# EAGLE design pcb_schematic (EAGLE 6.5.0)
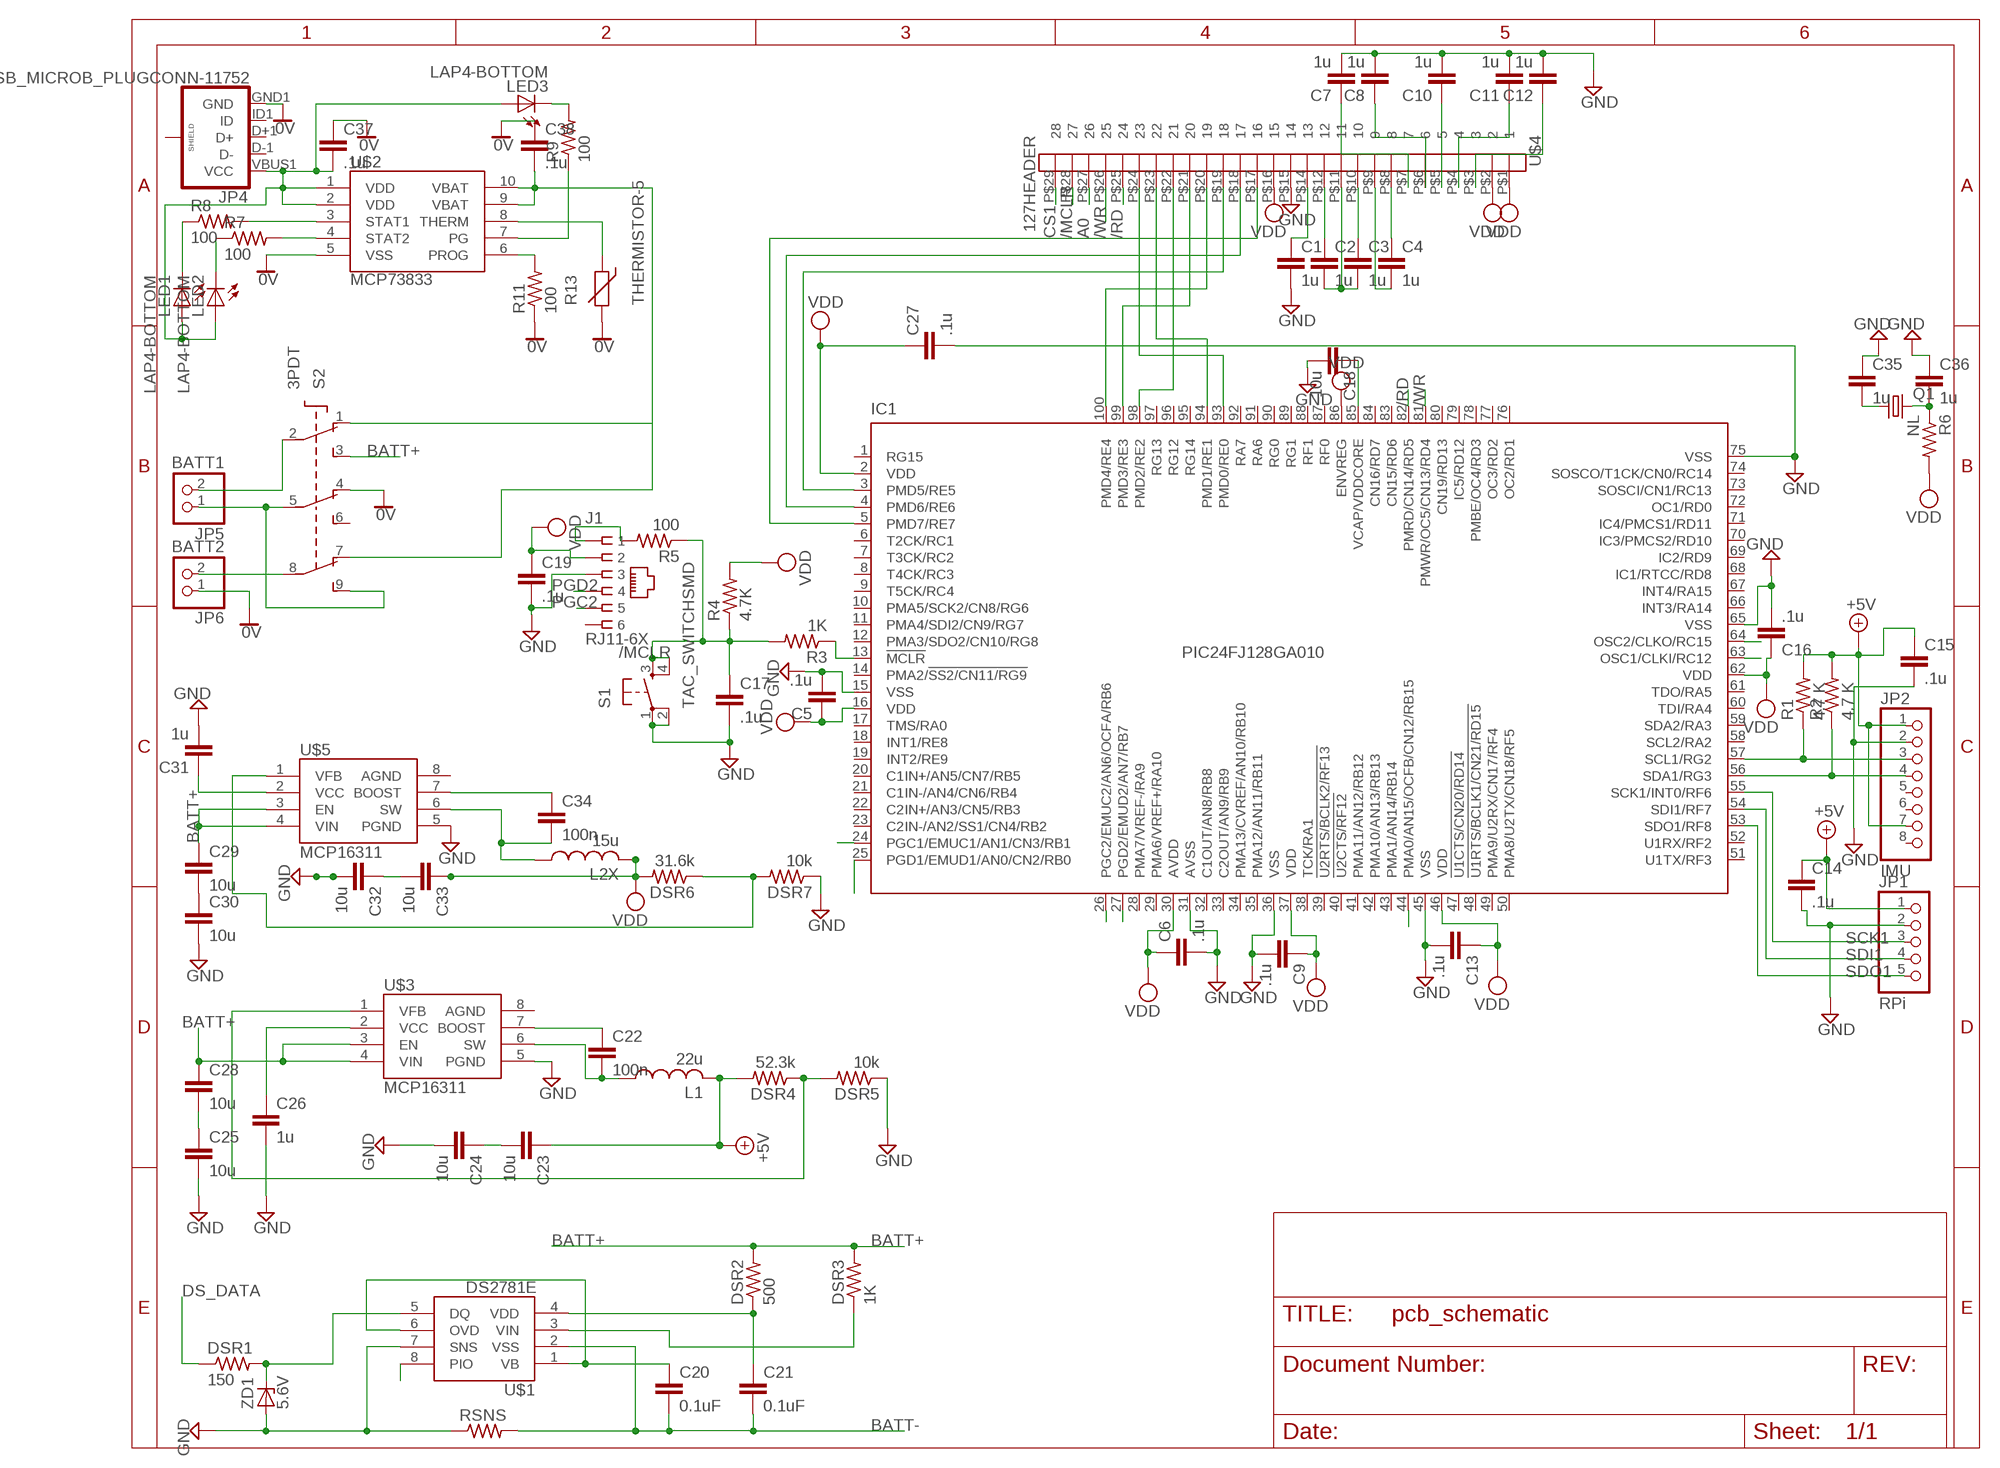
[diagram p0: schematic, sheet 1]

## Parts
C1  1u  C-EUC1206  [C1206]
C2  1u  C-EUC1206  [C1206]
C3  1u  C-EUC1206  [C1206]
C4  1u  C-EUC1206  [C1206]
C5  .1u  C-EUC1206  [C1206]
C6  .1u  C-EUC1206  [C1206]
C7  1u  C-EUC1206  [C1206]
C8  1u  C-EUC1206  [C1206]
C9  .1u  C-EUC1206  [C1206]
C10  1u  C-EUC1206  [C1206]
C11  1u  C-EUC1206  [C1206]
C12  1u  C-EUC1206  [C1206]
C13  .1u  C-EUC1206  [C1206]
C14  .1u  C-EUC1206  [C1206]
C15  .1u  C-EUC1206  [C1206]
C16  .1u  C-EUC1206  [C1206]
C17  .1u  C-EUC1206  [C1206]
C18  10u  C-EUC1206  [C1206]
C19  .1u  C-EUC1206  [C1206]
C20  0.1uF  C-EUC1206  [C1206]
C21  0.1uF  C-EUC1206  [C1206]
C22  100n  C-EUC1206  [C1206]
C23  10u  C-EUC1206  [C1206]
C24  10u  C-EUC1206  [C1206]
C25  10u  C-EUC1206  [C1206]
C26  1u  C-EUC1206  [C1206]
C27  .1u  C-EUC1206  [C1206]
C28  10u  C-EUC1206  [C1206]
C29  10u  C-EUC1206  [C1206]
C30  10u  C-EUC1206  [C1206]
C31  1u  C-EUC1206  [C1206]
C32  10u  C-EUC1206  [C1206]
C33  10u  C-EUC1206  [C1206]
C34  100n  C-EUC1206  [C1206]
C35  1u  C-EUC1206  [C1206]
C36  1u  C-EUC1206  [C1206]
C37  .1u  C-EUC1206  [C1206]
C38  .1u  C-EUC1206  [C1206]
DSR1  150  R-US_M2012  [M2012]
DSR2  500  R-US_M2012  [M2012]
DSR3  1K  R-US_M2012  [M2012]
DSR4  52.3k  R-US_M2012  [M2012]
DSR5  10k  R-US_M2012  [M2012]
DSR6  31.6k  R-US_M2012  [M2012]
DSR7  10k  R-US_M2012  [M2012]
IC1  PIC24FJ128GA010  [TQFP100-14X14]
J1  RJ11-6X  [RJ11-NO_SHIELD]
JP1  RPi  PINHD-1X5  [1X05]
JP2  IMU  PINHD-1X8  [1X08]
JP4  USB_MICROB_PLUGCONN-11752  [USB-B-MICRO-SMD_V03]
JP5  BATT1  PINHD-1X2  [1X02]
JP6  BATT2  PINHD-1X2  [1X02]
L1  22u  L-US0204/5  [0204/5]
L2X  15u  L-US0204/5  [0204/5]
LED1  LAP4-BOTTOM  [P47F-BOTTOM]
LED2  LAP4-BOTTOM  [P47F-BOTTOM]
LED3  LAP4-BOTTOM  [P47F-BOTTOM]
Q1  CRYTALHC49UP  [HC49UP]
R1  4.7 K  R-US_M2012  [M2012]
R2  4.7 K  R-US_M2012  [M2012]
R3  1K  R-US_M2012  [M2012]
R4  4.7K  R-US_M2012  [M2012]
R5  100  R-US_M2012  [M2012]
R6  NL  R-US_M2012  [M2012]
R7  100  R-US_M2012  [M2012]
R8  100  R-US_M2012  [M2012]
R9  100  R-US_M2012  [M2012]
R11  100  R-US_M2012  [M2012]
R13  THERMISTOR-5  [R-5]
RSNS  R-US_M2012  [M2012]
S1  TAC_SWITCHSMD  [TACTILE-SWITCH-SMD]
S2  3PDT  [3PDT]
U$1  DS2781E  [TSSOP8]
U$2  MCP73833  [MSOP10]
U$3  MCP16311  [MSOP8]
U$4  127HEADER  [1.27HEADER]
U$5  MCP16311  [MSOP8]
ZD1  5.6V  ZENER-DIODESOD80C  [SOD80C]

## Nets
0V: C37.1 C38.1 JP4.GND1(GND) JP6.1 R11.1 R13.2 S2.4(O2) U$2.5(VSS)
+5V: C14.1 C15.1 C23.1 DSR4.2 JP1.1 JP2.1 JP2.7 L1.2 R1.2 R2.2
/MCLR: C17.1 R3.2 R4.1 R5.1 S1.3 S1.4 U$4.P$28
/RD: IC1.82(PMRD/CN14/RD5) U$4.P$25
/WR: IC1.81(PMWR/OC5/CN13/RD4) U$4.P$26
A0: IC1.44(PMA0/AN15/OCFB/CN12/RB15) U$4.P$27
BATT+: C28.1 C29.1 DSR2.2 DSR3.2 S2.3(S1) U$3.3(EN) U$3.4(VIN) U$5.3(EN) U$5.4(VIN)
BATT-: C20.2 C21.2 RSNS.2 U$1.2(VSS)
CS1: U$4.P$29
DS_DATA: DSR1.1 IC1.25(PGD1/EMUD1/AN0/CN2/RB0)
GND: C1.2 C5.2 C6.2 C7.2 C8.2 C9.2 C10.2 C11.2 C12.2 C13.2 C14.2 C15.2 C16.2 C17.2 C18.2 C19.2 C24.2 C25.2 C26.2 C27.2 C30.2 C31.2 C32.2 C35.1 C36.1 DSR5.1 DSR7.1 IC1.15(VSS) IC1.31(AVSS) IC1.36(VSS) IC1.45(VSS) IC1.65(VSS) IC1.75(VSS) J1.3 JP1.2 JP2.2 RSNS.1 S1.1 S1.2 U$1.7(SNS) U$3.5(PGND) U$4.P$15 U$5.5(PGND) ZD1.A
N$1: IC1.57(SCL1/RG2) JP2.3 R1.1
N$2: IC1.56(SDA1/RG3) JP2.4 R2.1
N$3: LED1.C R8.1
N$5: R8.2 U$2.3(STAT1)
N$6: R7.2 U$2.4(STAT2)
N$7: C18.1 IC1.85(VCAP/VDDCORE)
N$8: IC1.5(PMD7/RE7) U$4.P$17
N$9: IC1.4(PMD6/RE6) U$4.P$18
N$10: IC1.3(PMD5/RE5) U$4.P$19
N$11: IC1.100(PMD4/RE4) U$4.P$20
N$12: IC1.99(PMD3/RE3) U$4.P$21
N$13: IC1.98(PMD2/RE2) U$4.P$22
N$14: IC1.94(PMD1/RE1) U$4.P$23
N$15: IC1.93(PMD0/RE0) U$4.P$24
N$16: C7.1 U$4.P$7
N$17: C3.1 U$4.P$10
N$18: LED2.C R7.1
N$19: C2.1 U$4.P$12
N$20: C2.2 C3.2 U$4.P$11
N$21: C1.1 U$4.P$14
N$22: C4.2 U$4.P$9
N$23: C4.1 U$4.P$8
N$24: C8.1 U$4.P$6
N$25: C10.1 U$4.P$5
N$26: C11.1 U$4.P$4
N$27: C12.1 U$4.P$3
N$28: R9.1 U$2.7(PG)
N$29: J1.1 R5.2
N$30: C25.1 C28.2
N$31: DSR1.2 U$1.5(DQ) ZD1.C
N$32: LED3.C R9.2
N$33: R11.2 U$2.6(PROG)
N$34: R13.1 U$2.8(THERM)
N$36: C21.1 DSR2.1 U$1.4(VDD)
N$37: C20.1 U$1.1(VB) U$1.6(OVD)
N$38: C22.2 L1.1 U$3.6(SW)
N$39: DSR3.1 U$1.3(VIN)
N$40: C22.1 U$3.7(BOOST)
N$41: DSR4.1 DSR5.2 U$3.1(VFB)
N$42: C23.2 C24.1
N$43: C26.1 U$3.2(VCC)
N$44: C29.2 C30.1
N$45: C32.1 C33.2
N$46: DSR6.1 DSR7.2 U$5.1(VFB)
N$47: C34.2 L2X.1 U$5.6(SW)
N$48: C34.1 U$5.7(BOOST)
N$49: C31.1 U$5.2(VCC)
N$50: IC1.13(!MCLR) R3.1
N$51: C38.2 S2.1(O1) S2.7(O3) U$2.9(VBAT) U$2.10(VBAT)
N$52: JP5.2 S2.2(P1)
N$54: JP6.2 S2.8(P3)
N$55: JP5.1 S2.5(P2) S2.9(S3)
OSC1: C36.2 IC1.63(OSC1/CLKI/RC12) Q1.2 R6.1
OSC2: C35.2 IC1.64(OSC2/CLKO/RC15) Q1.1
PGC2: IC1.26(PGC2/EMUC2/AN6/OCFA/RB6) J1.5
PGD2: IC1.27(PGD2/EMUD2/AN7/RB7) J1.4
PIO: IC1.24(PGC1/EMUC1/AN1/CN3/RB1) U$1.8(PIO)
SCK1: IC1.55(SCK1/INT0/RF6) JP1.3
SDI1: IC1.54(SDI1/RF7) JP1.4
SDO1: IC1.53(SDO1/RF8) JP1.5
VDD: C5.1 C6.1 C9.1 C13.1 C16.1 C19.1 C27.1 C33.1 DSR6.2 IC1.2(VDD) IC1.16(VDD) IC1.30(AVDD) IC1.37(VDD) IC1.46(VDD) IC1.62(VDD) IC1.86(ENVREG) J1.2 L2X.2 R4.2 R6.2 U$4.P$1 U$4.P$2 U$4.P$16
VDDUSB: C37.2 JP4.VBUS1(VCC) LED1.A LED2.A LED3.A U$2.1(VDD) U$2.2(VDD)
Unconnected: IC1.1(RG15) IC1.6(T2CK/RC1) IC1.7(T3CK/RC2) IC1.8(T4CK/RC3) IC1.9(T5CK/RC4) IC1.10(PMA5/SCK2/CN8/RG6) IC1.11(PMA4/SDI2/CN9/RG7) IC1.12(PMA3/SDO2/CN10/RG8) IC1.14(PMA2/!SS2/CN11/RG9) IC1.17(TMS/RA0) IC1.18(INT1/RE8) IC1.19(INT2/RE9) IC1.20(C1IN+/AN5/CN7/RB5) IC1.21(C1IN-/AN4/CN6/RB4) IC1.22(C2IN+/AN3/CN5/RB3) IC1.23(C2IN-/AN2/SS1/CN4/RB2) IC1.28(PMA7/VREF-/RA9) IC1.29(PMA6/VREF+/RA10) IC1.32(C1OUT/AN8/RB8) IC1.33(C2OUT/AN9/RB9) IC1.34(PMA13/CVREF/AN10/RB10) IC1.35(PMA12/AN11/RB11) IC1.38(TCK/RA1) IC1.39(!U2RTS/BCLK2/RF13) IC1.40(!U2CTS/RF12) IC1.41(PMA11/AN12/RB12) IC1.42(PMA10/AN13/RB13) IC1.43(PMA1/AN14/RB14) IC1.47(!U1CTS/CN20/RD14) IC1.48(!U1RTS/BCLK1/CN21/RD15) IC1.49(PMA9/U2RX/CN17/RF4) IC1.50(PMA8/U2TX/CN18/RF5) IC1.51(U1TX/RF3) IC1.52(U1RX/RF2) IC1.58(SCL2/RA2) IC1.59(SDA2/RA3) IC1.60(TDI/RA4) IC1.61(TDO/RA5) IC1.66(INT3/RA14) IC1.67(INT4/RA15) IC1.68(IC1/RTCC/RD8) IC1.69(IC2/RD9) IC1.70(IC3/PMCS2/RD10) IC1.71(IC4/PMCS1/RD11) IC1.72(OC1/RD0) IC1.73(SOSCI/CN1/RC13) IC1.74(SOSCO/T1CK/CN0/RC14) IC1.76(OC2/RD1) IC1.77(OC3/RD2) IC1.78(PMBE/OC4/RD3) IC1.79(IC5/RD12) IC1.80(CN19/RD13) IC1.83(CN15/RD6) IC1.84(CN16/RD7) IC1.87(RF0) IC1.88(RF1) IC1.89(RG1) IC1.90(RG0) IC1.91(RA6) IC1.92(RA7) IC1.95(RG14) IC1.96(RG12) IC1.97(RG13) J1.6 JP2.5 JP2.6 JP2.8 JP4.D+1(D+) JP4.D-1(D-) JP4.ID1(ID) JP4.SHIELD1(SHIELD) JP4.SHIELD2(SHIELD) JP4.SHIELD3(SHIELD) S2.6(S2) U$3.8(AGND) U$5.8(AGND)

## Library data of the parts
C1-C38 = rcl:C-EU: CAPACITOR, European symbol
DSR1-DSR7 R1-R9 R11 RSNS = rcl:R-US_: RESISTOR, American symbol
IC1 = microchip:PIC24FJ*GA010: 64/80/100-Pin General Purpose, 16-Bit Flash Microcontrollers Source: http://ww1.microchip.com/downloads/en/DeviceDoc/39747d.pdf; MPN: PIC24FJ128GA010-I/PT; OC_FARNELL: 1146522; OC_NEWARK: 56K7341
J1 = con-tycoelectronics:RJ11: CORCOM Modular RJ Jacks No Shield Source: www.tycoelectronics.com .. ENG_DS_1654001_1099_RJ_L_0507.pdf; MPN: RJ11-6X; OC_FARNELL: unknown; OC_NEWARK: 16R6089
JP1 = pinhead:PINHD-1X5: PIN HEADER
JP2 = pinhead:PINHD-1X8: PIN HEADER
JP4 = SparkFun-Connectors:USB_MICROB_PLUG: USB Micro-B connectors Some male, some female. Watch your step!
JP5 JP6 = pinhead:PINHD-1X2: PIN HEADER
L1 L2X = rcl:L-US: INDUCTOR, American symbol
LED1-LED3 = led:*P4: PointLED® Enhanced Thinfilm LED TOP & BOTTOM mount LS P47F, LR P47F, LA P47F, LY P47F, LT P4SG, LB P4SG, LW P4SG Source: http://catalog.osram-os.com .. LA_LR_LS_LY_P47F_Pb_free.pdf
Q1 = crystal:CRYTAL: CRYSTAL
R13 = varistor:THERMISTOR: THERMISTOR
S1 = SparkFun-Retired:TAC_SWITCH: Momentary Switch Button commonly used for reset or general input. Spark Fun Electronics SKU : COM-00097 SMT- SWCH-08247; PROD_ID: SWCH-08247
S2 = switch:3PDT: 3PDT 9 pin footswitch SF17020F-0302-21R-L Source: 3PDT.jpg
U$1 = fuelgauge:DS2781E
U$2 = fuelgauge:MCP73833
U$3 U$5 = fuelgauge:MCP16311
U$4 = fuelgauge:127HEADER
ZD1 = diode:ZENER-DIODE: Z-Diode

## Board
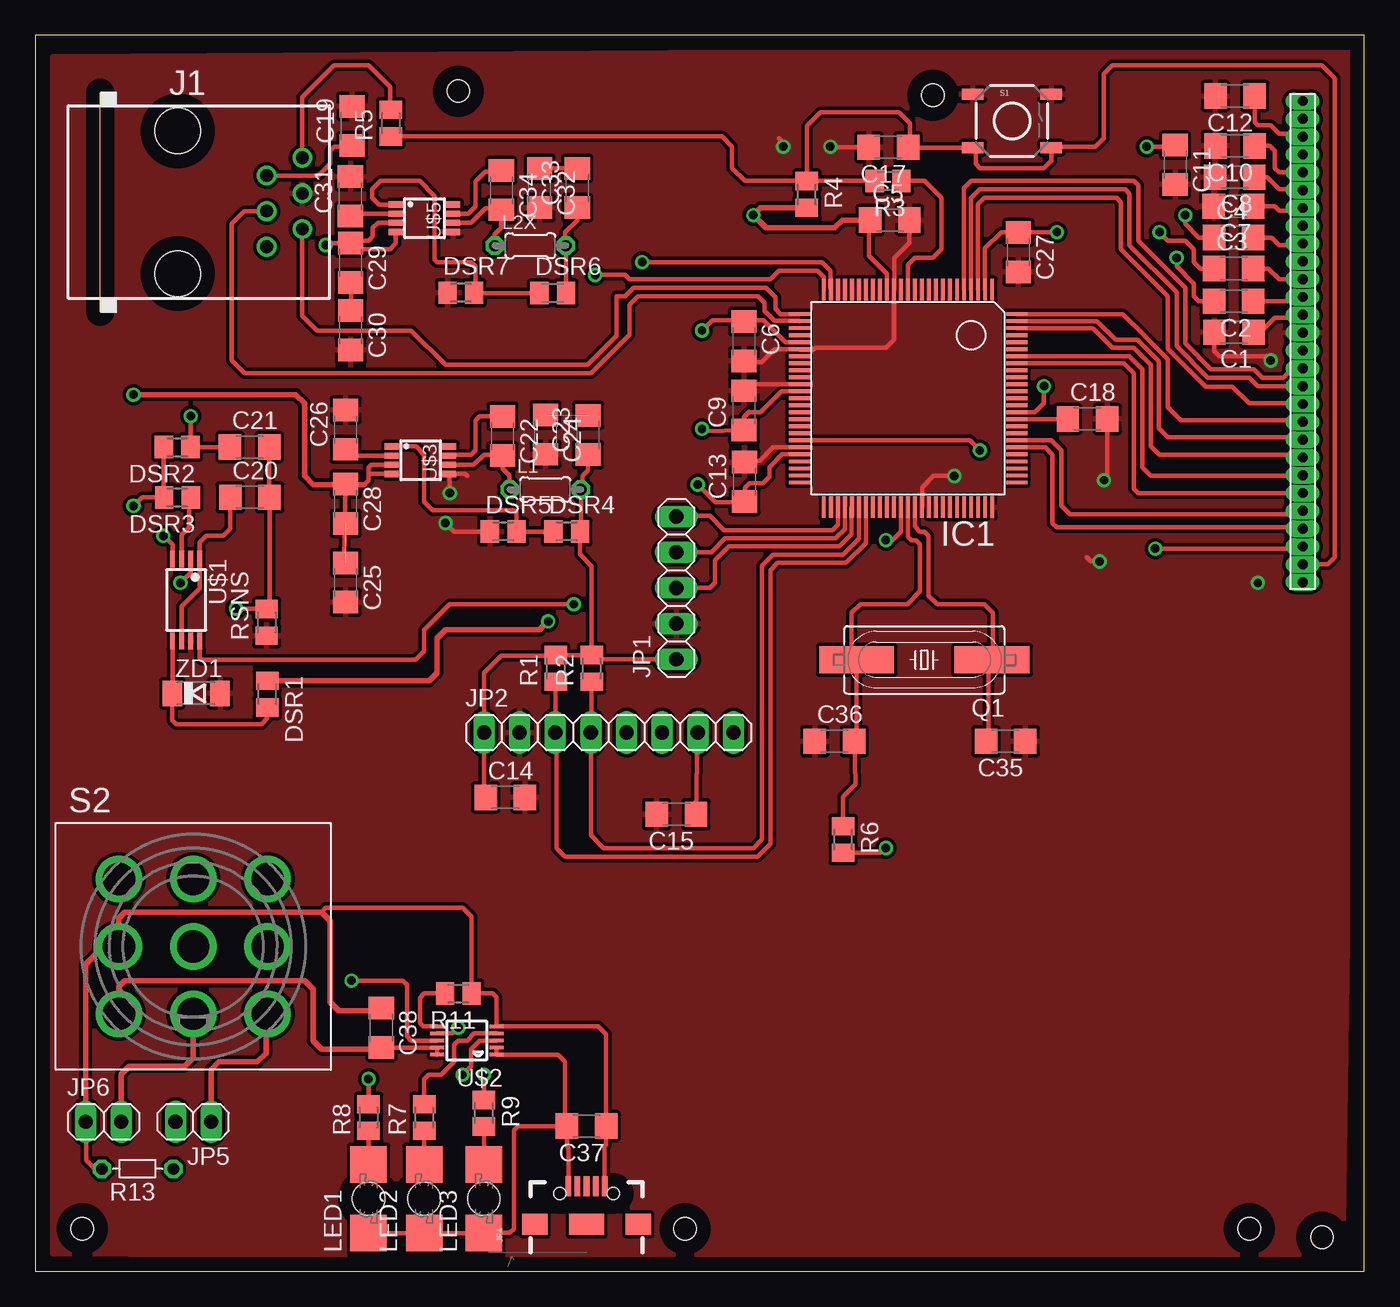
[diagram p1: board, top side]
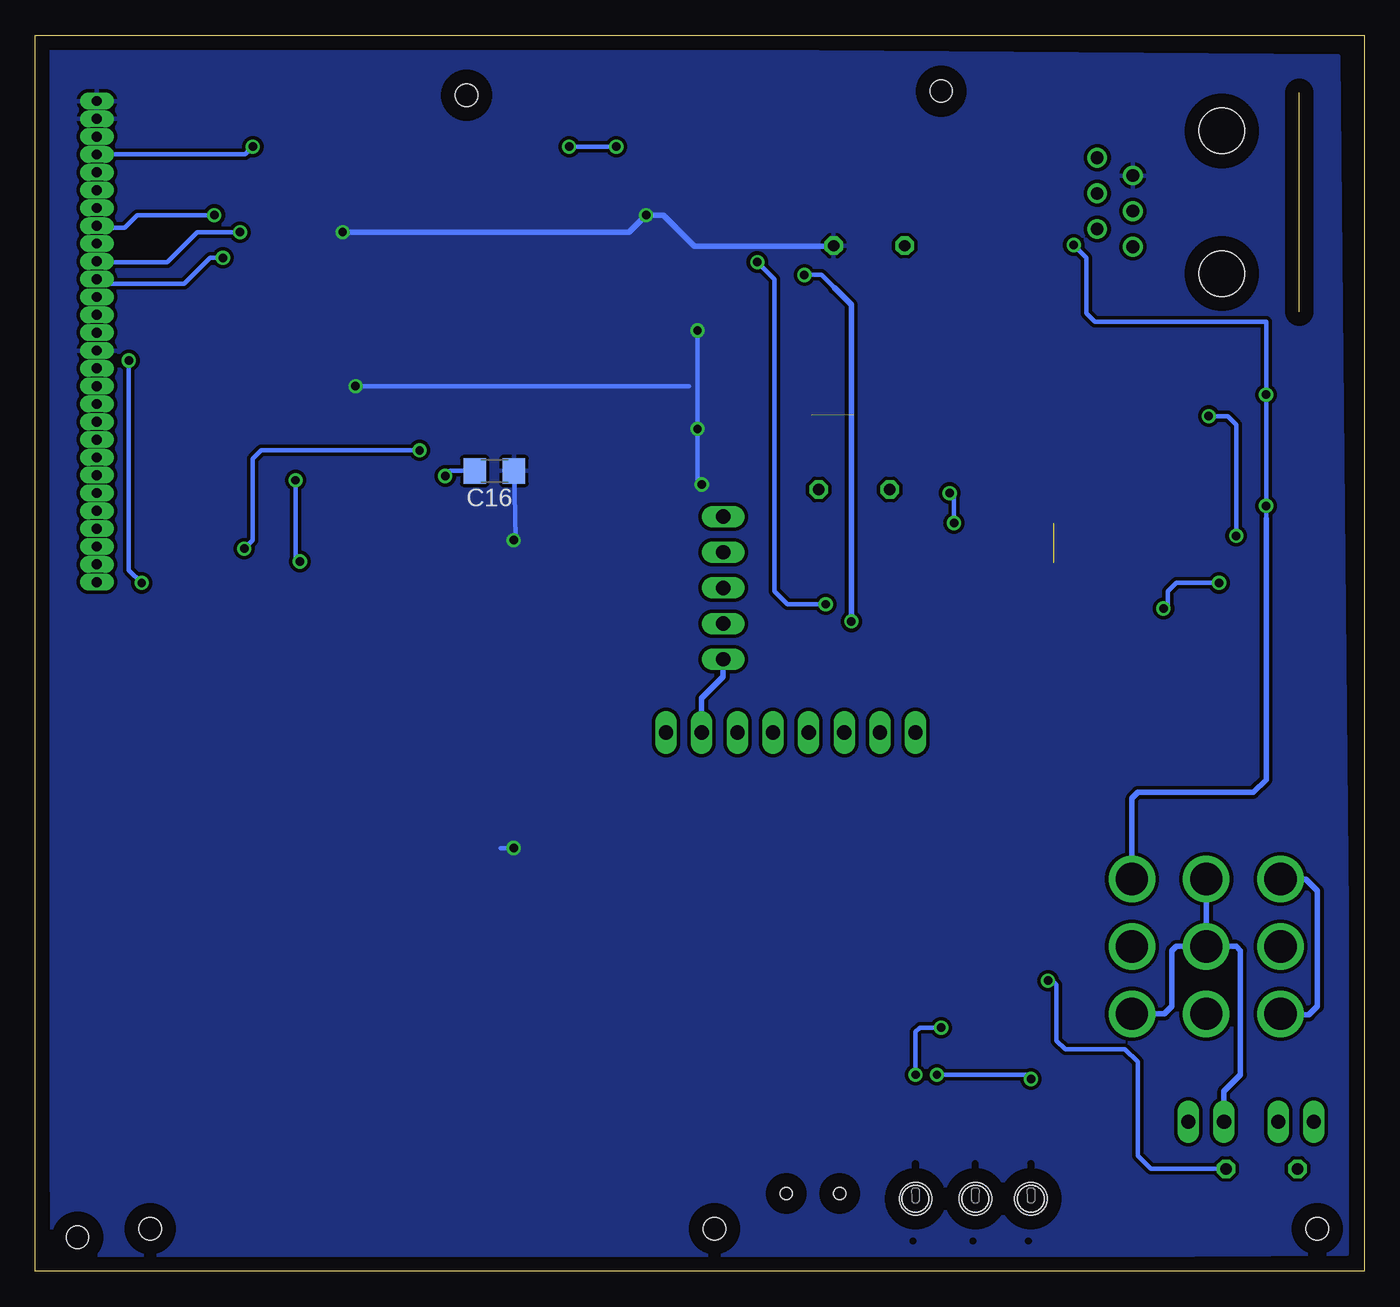
[diagram p2: board, bottom side, seen from below]

Size 94.77 x 88.11 mm. Coordinates in mm from the lower left corner, seen from the top.
Outline: 0,0 94.77,0 94.77,88.11 0,88.11 0,0
Copper layers (1*16): Top 0.035mm / dielectric 1.5mm / Bottom 0.035mm
Design rules "default": minimum track width 10mil, minimum drill 24mil, track to track 8mil, track to pad 8mil, pad to pad 8mil, via to via 8mil, smd to smd 8mil, copper to edge 40mil, drill to drill 8mil, minimum pad ring 10mil, minimum via ring 8mil, stop-mask expansion 4mil, vias tented up to drill 0mil, thermal gap 10mil
Holes 1.6 mm at 91.74,2.44 3.35,3.05 30.18,84.12 64.01,83.82 46.33,3.05 86.56,3.05

### Footprints (pad centres in the part's own frame; a part is rotated, then mirrored left to right if it is on the bottom)
C1206 = smd 1.6 x 1.8: 1 -1.4,0; 2 1.4,0
M2012 = smd 1.3 x 1.6: 1 -0.95,0; 2 0.95,0
TQFP100-14X14 = smd 0.27 x 1.5: 1 -6,-7.75; 2 -5.5,-7.75; 3 -5,-7.75; 4 -4.5,-7.75; 5 -4,-7.75; 6 -3.5,-7.75; 7 -3,-7.75; 8 -2.5,-7.75; 9 -2,-7.75; 10 -1.5,-7.75; 11 -1,-7.75; 12 -0.5,-7.75; 13 0,-7.75; 14 0.5,-7.75; 15 1,-7.75; 16 1.5,-7.75; 17 2,-7.75; 18 2.5,-7.75; 19 3,-7.75; 20 3.5,-7.75; 21 4,-7.75; 22 4.5,-7.75; 23 5,-7.75; 24 5.5,-7.75; 25 6,-7.75; 51 6,7.75; 52 5.5,7.75; 53 5,7.75; 54 4.5,7.75; 55 4,7.75; 56 3.5,7.75; 57 3,7.75; 58 2.5,7.75; 59 2,7.75; 60 1.5,7.75; 61 1,7.75; 62 0.5,7.75; 63 0,7.75; 64 -0.5,7.75; 65 -1,7.75; 66 -1.5,7.75; 67 -2,7.75; 68 -2.5,7.75; 69 -3,7.75; 70 -3.5,7.75; 71 -4,7.75; 72 -4.5,7.75; 73 -5,7.75; 74 -5.5,7.75; 75 -6,7.75 | smd 1.5 x 0.27: 26 7.75,-6; 27 7.75,-5.5; 28 7.75,-5; 29 7.75,-4.5; 30 7.75,-4; 31 7.75,-3.5; 32 7.75,-3; 33 7.75,-2.5; 34 7.75,-2; 35 7.75,-1.5; 36 7.75,-1; 37 7.75,-0.5; 38 7.75,0; 39 7.75,0.5; 40 7.75,1; 41 7.75,1.5; 42 7.75,2; 43 7.75,2.5; 44 7.75,3; 45 7.75,3.5; 46 7.75,4; 47 7.75,4.5; 48 7.75,5; 49 7.75,5.5; 50 7.75,6; 76 -7.75,6; 77 -7.75,5.5; 78 -7.75,5; 79 -7.75,4.5; 80 -7.75,4; 81 -7.75,3.5; 82 -7.75,3; 83 -7.75,2.5; 84 -7.75,2; 85 -7.75,1.5; 86 -7.75,1; 87 -7.75,0.5; 88 -7.75,0; 89 -7.75,-0.5; 90 -7.75,-1; 91 -7.75,-1.5; 92 -7.75,-2; 93 -7.75,-2.5; 94 -7.75,-3; 95 -7.75,-3.5; 96 -7.75,-4; 97 -7.75,-4.5; 98 -7.75,-5; 99 -7.75,-5.5; 100 -7.75,-6
RJ11-NO_SHIELD = drill 0.9 pad 1.4: 1 -3.175,8.89; 2 -1.905,6.35; 3 -0.635,8.89; 4 0.635,6.35; 5 1.905,8.89; 6 3.175,6.35 | hole 3.251: -5.08,0; 5.08,0
1X05 = drill 1.016 long: 1 -5.08,0; 2 -2.54,0; 3 0,0; 4 2.54,0; 5 5.08,0
1X08 = drill 1.016 long: 1 -8.89,0; 2 -6.35,0; 3 -3.81,0; 4 -1.27,0; 5 1.27,0; 6 3.81,0; 7 6.35,0; 8 8.89,0
USB-B-MICRO-SMD_V03 = smd 1.45 x 0.4: D+1 2.725,0; D-1 2.725,0.65; GND1 2.725,-1.3; ID1 2.725,-0.65; VBUS1 2.725,1.3 | smd 1.5 x 1.8: SHIELD1 0,3.685; SHIELD2 0,-3.685 | smd 1.5 x 2.5: SHIELD3 0,0 | hole 0.85: 2.2,1.9; 2.2,-1.9
1X02 = drill 1.016 long: 1 -1.27,0; 2 1.27,0
0204/5 = drill 0.813 octagon: 1 -2.54,0; 2 2.54,0
P47F-BOTTOM = smd 2.6 x 2.6: A -2.45,0; C 2.45,0 | hole 2.3: 0,0
HC49UP = smd 5.334 x 1.93: 1 -4.826,0; 2 4.826,0
R-5 = drill 0.813 octagon: 1 -2.54,0; 2 2.54,0
TACTILE-SWITCH-SMD = smd 1.524 x 0.762: 1 -2.794,1.905; 2 2.794,1.905; 3 -2.794,-1.905; 4 2.794,-1.905
3PDT = drill 2.3 pad 3.1: 1 -5.3,4.8; 2 0,4.8; 3 5.3,4.8; 4 -5.3,0; 5 0,0; 6 5.3,0; 7 -5.3,-4.8; 8 0,-4.8; 9 5.3,-4.8
TSSOP8 = smd 1.2 x 0.35: 1 -2.925,0.975; 2 -2.925,0.325; 3 -2.925,-0.325; 4 -2.925,-0.975; 5 2.925,-0.975; 6 2.925,-0.325; 7 2.925,0.325; 8 2.925,0.975
MSOP10 = smd 0.25 x 1: 1 -1,-2.113; 2 -0.5,-2.113; 3 0,-2.113; 4 0.5,-2.113; 5 1,-2.113; 6 1,2.113; 7 0.5,2.113; 8 0,2.113; 9 -0.5,2.113; 10 -1,2.113
MSOP8 = smd 0.45 x 1: 1 -0.975,-2.05; 2 -0.325,-2.05; 3 0.325,-2.05; 4 0.975,-2.05; 5 0.975,2.05; 6 0.325,2.05; 7 -0.325,2.05; 8 -0.975,2.05
1.27HEADER = drill 0.7 pad 0.813 long: P$1 0.406,0.457; P$2 1.676,0.457; P$3 2.946,0.457; P$4 4.216,0.457; P$5 5.486,0.457; P$6 6.756,0.457; P$7 8.026,0.457; P$8 9.296,0.457; P$9 10.566,0.457; P$10 11.836,0.457; P$11 13.106,0.457; P$12 14.376,0.457; P$14 15.646,0.457; P$15 16.916,0.457; P$16 18.186,0.457; P$17 19.456,0.457; P$18 20.726,0.457; P$19 21.996,0.457; P$20 23.266,0.457; P$21 24.536,0.457; P$22 25.806,0.457; P$23 27.076,0.457; P$24 28.346,0.457; P$25 29.616,0.457; P$26 30.886,0.457; P$27 32.156,0.457; P$28 33.426,0.457; P$29 34.696,0.457
SOD80C = smd 1.4 x 1.8: A 1.7,0; C -1.7,0

### Placement (x,y rotation side)
C1  85.47,66.93 180 top
C2  85.45,69.14 180 top
C3  85.45,71.48 0 top
C4  85.45,73.69 0 top
C5  60.93,74.93 0 top
C6  50.55,66.29 270 top
C7  85.42,75.92 180 top
C8  85.52,77.98 180 top
C9  50.55,61.37 90 top
C10  85.55,80.21 180 top
C11  81.28,78.87 270 top
C12  85.55,83.77 180 top
C13  50.57,56.29 90 top
C14  33.53,33.78 0 top
C15  45.72,32.59 180 top
C16  62.03,57.05 180 bottom
C17  60.83,80.11 180 top
C18  75.03,60.76 0 top
C19  22.61,81.64 90 top
C20  15.32,55.17 0 top
C21  15.29,58.75 0 top
C22  33.32,59.54 270 top
C23  39.42,59.61 90 top
C24  36.4,59.64 270 top
C25  22.15,49.1 270 top
C26  22.15,59.99 90 top
C27  70.1,72.64 270 top
C28  22.15,54.71 270 top
C29  22.5,71.88 270 top
C30  22.5,67.08 270 top
C31  22.48,76.63 90 top
C32  35.97,77.22 270 top
C33  38.66,77.22 90 top
C34  33.25,77.06 270 top
C35  69.19,37.8 180 top
C36  57,37.8 0 top
C37  39.32,10.36 180 top
C38  24.69,17.37 270 top
DSR1  16.56,41.15 270 top
DSR2  10.13,58.75 180 top
DSR3  10.16,55.17 180 top
DSR4  37.9,52.73 0 top
DSR5  33.38,52.73 0 top
DSR6  36.91,69.72 0 top
DSR7  30.35,69.75 0 top
IC1  62.23,62.23 180 top
J1  10.16,76.2 270 top
JP1  45.72,48.72 90 top
JP2  40.89,38.4 0 top
JP4  39.32,3.35 90 top
JP5  11.28,10.67 180 top
JP6  4.88,10.67 0 top
L1  36.37,55.73 0 top
L2X  35.31,73.1 0 top
LED1  23.77,5.18 90 top
LED2  27.74,5.18 90 top
LED3  32,5.18 90 top
Q1  63.4,43.59 180 top
R1  37.11,42.98 90 top
R2  39.67,42.98 90 top
R3  60.81,77.72 180 top
R4  55.02,76.76 270 top
R5  25.35,81.84 90 top
R6  57.61,30.78 270 top
R7  27.74,10.97 90 top
R8  23.77,10.97 90 top
R9  32,11.28 270 top
R11  30.18,19.81 180 top
R13  7.32,7.32 180 top
RSNS  16.51,46.25 90 top
S1  69.65,81.99 0 top
S2  11.28,23.16 0 top
U$1  10.77,47.85 270 top
U$2  30.78,16.46 90 top
U$3  27.48,57.81 270 top
U$4  89.92,83.82 270 top
U$5  27.76,75.06 270 top
ZD1  11.48,41.2 0 top

### Tracks (layer width: path | path; a pad name or v marks a point on that pad's centre or on a via)
0V
  Top 0.305: JP4.GND1 40.62,8.94 40.72,9.04 C37.1 40.72,16.89 40.13,17.48 32.91,17.48 U$2.5 32.9,19.53 32.61,19.81 R11.1 31.12,25.26 30.48,25.91 20.73,25.91 20.42,25.6 | R13.2 4.27,7.32 3.66,7.92 3.66,10.62 JP6.1
  Top 0.406: JP6.1 3.61,21.89 4.57,22.86 5.67,22.86 S2.4 5.98,25.18 6.4,25.6 20.42,25.6 21.03,24.99 21.03,19.2 21.64,18.59 24.51,18.59 C38.1
+5V
  Top 0.305: C15.1 47.22,38.38 JP2.7 | C14.1 32,33.81 JP2.1 32,42.67 33.22,43.89 37.07,43.89 R1.2 R2.2 | C23.1 39.42,57.1 39.01,56.69 39.01,55.83 L1.2 38.91,52.8 DSR4.2 38.84,52.72 38.84,51.1 39.67,50.27 R2.2 | JP1.1 39.96,43.64 R2.2
  Bottom 0.406: JP1.1 45.72,42.37 47.24,40.84 JP2.7
/MCLR
  Top 0.305: 62.36,80.09 S1.3 67.06,79.88 67.06,78.94 67.36,78.64 71.93,78.64 72.44,79.15 S1.4 72.52,80.16 75.59,80.16 76.2,80.77 76.2,85.34 76.81,85.95 91.75,85.95 92.66,85.04 92.66,50.9 92.15,50.39 U$4.P$28 | 62.36,80.09 C17.1 | R3.2 55.03,77.72 R4.1 | 62.36,80.09 62.36,81.81 61.57,82.6 55.98,82.6 55.02,81.64 R4.1 | R5.1 48.96,80.89 49.68,80.16 49.68,78.64 50.6,77.72 55,77.72 R4.1
/RD
  Top 0.305: IC1.82 72.44,59.23 73.15,58.52 73.15,54.56 73.76,53.95 90.12,53.95 U$4.P$25
/WR
  Top 0.305: IC1.81 72.03,58.73 72.54,58.22 72.54,53.34 72.85,53.03 90.27,53.03 U$4.P$26
A0  (via drill 0.6)
  Top 0.305: IC1.44 66.65,59.23 v67.36,58.52 | v79.86,51.51 90.22,51.51 U$4.P$27
  Bottom 0.305: v67.36,58.52 78.64,58.52 79.25,57.91 79.25,52.12 v79.86,51.51
BATT+  (via drill 0.6)
  Top 0.305: U$5.3 24.44,74.73 24.08,74.37 24.08,73.76 23.77,73.46 22.68,73.46 C29.1 | U$5.4 25.71,73.26 25.3,72.85 22.94,72.85 C29.1 | C29.1 20.86,73.28 v20.73,73.15 | 22.02,50.8 C28.1 22.18,56.08 | DSR2.2 9.19,55.19 DSR3.2 7.62,55.17 v7.01,54.56 | U$3.3 23.96,57.48 23.77,57.3 23.77,56.69 | 23.77,56.69 23.77,56.39 23.47,56.08 | U$3.4 23.92,56.84 23.77,56.69
  Top 0.406: v7.01,62.48 18.59,62.48 19.2,61.87 19.2,56.69 19.81,56.08 22.18,56.08 23.47,56.08
  Bottom 0.305: 7.01,52.73 7.01,53.65 v7.01,54.56 v7.01,62.48 7.01,67.67 19.2,67.67 19.81,68.28 19.81,72.24 v20.73,73.15
  Bottom 0.406: S2.3 16.58,33.71 16.15,34.14 7.92,34.14 7.01,35.05 7.01,53.65
BATT-  (via drill 0.6)
  Top 0.305: C21.2 16.69,55.1 16.46,54.86 16.46,54.91 C20.2 16.72,47.41 RSNS.2 16.47,47.24 v14.33,47.24 | U$1.2 11.1,49.8 v10.36,49.07
  Bottom 0.305: v10.36,49.07 13.41,49.07 14.02,48.46 14.02,47.55 v14.33,47.24
DS_DATA  (via drill 0.6)
  Top 0.305: IC1.25 56.24,70.87 55.78,71.32 55.17,71.32 54.56,71.32 53.03,71.32 52.43,70.71 42.37,70.71 42.06,71.02 v39.93,71.02
  Top 0.406: DSR1.1 28.08,42.1 28.65,42.67 28.65,45.11 29.26,45.72 35.97,45.72 v36.58,46.33
  Bottom 0.305: 37.8,70.1 38.71,71.02 v39.93,71.02
  Bottom 0.406: v36.58,46.33 36.58,68.89 37.8,70.1
GND  (via drill 0.6)
  Top 0.305: C6.2 50.55,64.8 51.79,64.8 52.73,65.73 IC1.31 54.53,65.68 55.5,65.68 55.65,65.84 60.66,65.84 61.23,66.41 IC1.15 61.27,70.02 61.27,72.24 62.34,73.31 C5.2 | IC1.45 52.61,58.73 51.66,57.78 50.57,57.78 C13.2 | IC1.36 50.91,63.23 C9.2 | v65.53,56.69 64.06,56.69 63.25,55.88 63.25,54.5 IC1.65 | 30.79,56.69 30.64,56.84 U$3.5 29.57,56.8 v29.57,55.47 | DSR5.1 29.87,52.73 v29.26,53.34 | C18.2 76.43,56.62 v76.2,56.39 | v75.89,50.6 75.29,50.6 74.98,50.9 | C1.2 84.07,65.59 84.43,65.23 87.78,65.23 v88.09,64.92 | C17.2 56.74,80.11 v56.69,80.16 | v53.34,80.16 53.34,80.47 53.03,80.77
  Bottom 0.305: C16.2 65.18,57.05 v65.53,56.69 | v29.26,53.34 29.26,55.17 v29.57,55.47 | v76.2,56.39 76.2,50.9 v75.89,50.6 | v88.09,64.92 88.09,49.99 v87.17,49.07 | v56.69,80.16 v53.34,80.16
  pour Top (isolate 0.254): 1.27,86.56 94.44,87.17 93.22,0.66 1.27,1.27
N$1
  Top 0.305: R1.1 37.11,38.43 JP2.3 37.19,38.3 37.19,30.18 37.8,29.57 51.51,29.57 52.43,30.48 52.43,49.99 52.93,50.49 57.81,50.49 59.23,51.91 IC1.57
N$2
  Top 0.305: R2.1 39.67,38.46 JP2.4 39.62,31.09 40.54,30.18 51.21,30.18 51.82,30.79 51.82,50.29 52.6,51.08 57.58,51.08 58.73,52.23 IC1.56
N$3
  Top 0.305: R8.1 LED1.C
N$5  (via drill 0.6)
  Top 0.305: U$2.3 31.7,16.46 31.09,15.85 31.09,14.63 v30.48,14.02 | v23.77,13.72 R8.2
  Bottom 0.305: v30.48,14.02 24.08,14.02 v23.77,13.72
N$6
  Top 0.305: U$2.4 31.29,16.96 30.79,16.46 30.18,16.46 29.87,16.15 29.87,14.94 28.96,14.02 28.04,14.02 27.74,13.72 R7.2
N$7
  Top 0.305: IC1.85 73.5,60.73 C18.1
N$8
  Top 0.305: IC1.5 66.23,77.2 66.75,77.72 78.33,77.72 78.64,77.42 78.64,73.46 81.99,70.1 81.99,66.14 83.82,64.31 86.87,64.31 87.48,63.7 89,63.7 89.61,64.31 90.32,64.31 U$4.P$17
N$9
  Top 0.305: IC1.4 66.73,76.48 67.36,77.11 77.72,77.11 78.03,76.81 78.03,73.15 81.38,69.8 81.38,65.94 83.62,63.7 86.56,63.7 87.17,63.09 U$4.P$18
N$10
  Top 0.305: IC1.3 67.23,76.07 67.67,76.5 77.11,76.5 77.42,76.2 77.42,72.85 80.77,69.49 80.77,65.76 83.46,63.07 85.37,63.07 86.56,61.87 90.32,61.87 U$4.P$19
N$11
  Top 0.305: IC1.100 77.57,68.23 79.12,66.67 79.12,66.65 80.75,65.02 80.75,61.59 81.69,60.66 90.27,60.66 U$4.P$20
N$12
  Top 0.305: IC1.99 75.7,67.73 77.04,66.4 78.59,66.4 80.11,64.87 80.11,60.1 80.77,59.44 90.22,59.44 U$4.P$21
N$13
  Top 0.305: IC1.98 75.42,67.23 76.81,65.84 78.33,65.84 79.55,64.62 79.55,58.83 80.16,58.22 90.17,58.22 U$4.P$22
N$14
  Top 0.305: IC1.94 78.03,65.23 78.94,64.31 78.94,57.3 79.55,56.69 90.32,56.69 U$4.P$23
N$15
  Top 0.305: IC1.93 77.61,64.73 78.33,64.01 78.33,55.78 78.64,55.47 U$4.P$24
N$16
  Top 0.305: C7.1 88.37,75.92 88.7,75.59 90.17,75.59 U$4.P$7
N$17  (via drill 0.6)
  Top 0.305: C3.1 83.06,71.48 82.6,71.93 82.6,72.85 81.99,73.46 80.77,73.46 v80.16,74.07
  Bottom 0.305: v80.16,74.07 83.21,74.07 85.34,71.93 90.32,71.93 U$4.P$10
N$18
  Top 0.305: R7.1 LED2.C
N$19
  Top 0.305: C2.1 90.07,69.14 U$4.P$12
N$20  (via drill 0.6)
  Top 0.305: C3.2 87.94,71.48 88.7,70.71 U$4.P$11 | C2.2 82.96,69.14 82.6,69.49 82.6,70.41 81.38,71.63 v81.38,72.24
  Bottom 0.305: v81.38,72.24 82.3,72.24 84.12,70.41 90.07,70.41 U$4.P$11
N$21
  Top 0.305: C1.1 87.35,66.93 88.39,67.97 90.17,67.97 U$4.P$14
N$22
  Top 0.305: C4.2 88.16,73.69 88.7,73.15 90.27,73.15 U$4.P$9
N$23  (via drill 0.6)
  Top 0.305: C4.1 82.98,73.69 81.99,74.68 v81.99,75.29
  Bottom 0.305: v81.99,75.29 87.48,75.29 88.39,74.37 90.22,74.37 U$4.P$8
N$24
  Top 0.305: C8.1 87.83,77.98 88.7,77.11 90.32,77.11 U$4.P$6
N$25
  Top 0.305: C10.1 88.04,80.21 88.39,79.86 88.39,78.64 88.7,78.33 U$4.P$5
N$26  (via drill 0.6)
  Top 0.305: v79.25,80.16 81.17,80.16 C11.1
  Bottom 0.305: U$4.P$4 79.81,79.6 v79.25,80.16
N$27
  Top 0.305: C12.1 86.95,81.91 87.17,81.69 88.09,81.69 88.7,81.08 90.17,81.08 U$4.P$3
N$28  (via drill 0.6)
  Top 0.305: U$2.7 29.76,16.96 v30.18,17.37 | v32,14.02 R9.1
  Bottom 0.305: v30.18,17.37 31.7,17.37 32,17.07 v32,14.02
N$29
  Top 0.305: J1.1 19.05,83.67 21.34,85.95 23.77,85.95 25.3,84.43 25.3,82.84 R5.2
N$30  (1 unrouted)
N$31
  Top 0.305: U$1.5 9.79,41.21 ZD1.C 9.78,39.29 10.06,39.01 16.15,39.01 16.56,39.42 DSR1.2
N$32
  Top 0.305: R9.2 LED3.C
N$33
  Top 0.305: U$2.6 27.65,17.46 27.43,17.68 27.43,19.51 27.74,19.81 R11.2
N$34  (via drill 0.6)
  Top 0.305: U$2.8 26.82,16.46 26.52,16.76 26.52,20.42 26.21,20.73 v22.55,20.73
  Bottom 0.305: R13.1 15.24,7.32 16.15,8.23 16.15,14.94 17.07,15.85 21.34,15.85 21.95,16.46 21.95,20.42 22.25,20.73 v22.55,20.73
N$35
  pour Top (isolate 0.254): 27.79,15.98 28.47,15.98 28.7,15.75 28.7,14.99 28.65,14.94 25.91,14.94 25.6,15.24 25.6,16.15
N$36  (via drill 0.6)
  Top 0.305: C21.1 DSR2.1 11.1,58.77 v11.1,60.96 | U$1.4 9.79,51.77 v9.14,52.43
  Bottom 0.305: v9.14,52.43 9.14,60.35 9.75,60.96 v11.1,60.96
N$37
  Top 0.305: U$1.6 10.45,47.4 11.73,48.69 11.73,50.77 U$1.1 11.73,51.97 12.19,52.43 13.41,52.43 13.92,52.93 C20.1
N$38
  Top 0.305: U$3.6 31.27,57.48 32,58.22 33.25,58.22 C22.2 33.33,57.2 33.83,56.69 L1.1
N$39
  Top 0.305: U$1.3 10.45,52.51 10.97,53.03 10.97,55.03 DSR3.1
N$40
  Top 0.305: C22.1 31.68,60.94 31.39,60.66 31.39,58.52 31.09,58.22 29.61,58.22 U$3.7
N$41
  Top 0.305: DSR4.1 DSR5.2 34.33,54.07 34.14,54.25 28.35,54.25 27.74,54.86 27.74,58.22 27.15,58.8 25.45,58.8 U$3.1
N$42  (1 unrouted)
N$43
  Top 0.305: U$3.2 22.47,58.13 C26.1
N$44
  Top 0.305: C29.2 22.53,69.32 C30.1
N$45
  Top 0.305: C33.2 C32.1
N$46
  Top 0.305: U$5.1 24.51,76.02 24.03,76.5 24.03,77.11 24.64,77.72 27.41,77.72 28.5,76.63 28.5,72.08 28.65,71.93 31.09,71.93 31.39,71.63 31.39,69.84 DSR7.2 31.33,69.72 DSR6.1
N$47
  Top 0.305: U$5.6 31.07,74.73 32.11,75.77 33.22,75.77 C34.2 33.22,75.64 33.22,74.37 32.77,73.91 L2X.1
N$48
  Top 0.305: U$5.7 30.86,75.38 31.39,75.92 31.39,77.7 32.08,78.38 33.2,78.38 C34.1
N$49
  Top 0.305: U$5.2 22.31,75.38 C31.1
N$50
  Top 0.305: R3.1 63.4,77.72 64.62,76.5 64.62,72.85 64.01,72.24 62.71,72.24 62.23,71.75 IC1.13
N$51
  Top 0.305: C38.2 24.7,15.96 U$2.9 U$2.10
  Top 0.406: S2.7 5.98,20.3 6.4,20.73 19.2,20.73 19.81,20.12 19.81,16.46 20.42,15.85 24.57,15.85 C38.2
  Bottom 0.406: S2.1 4.19,27.96 3.35,27.13 3.35,18.9 3.96,18.29 5.9,18.29 S2.7
N$52
  Bottom 0.406: JP5.2 10.01,12.85 8.84,14.02 8.84,22.86 9.14,23.16 11.28,23.16 S2.2
N$54
  Top 0.406: JP6.2 6.15,14.07 6.71,14.63 10.67,14.63 11.28,15.24 S2.8
N$55
  Top 0.406: JP5.1 12.55,14.38 13.11,14.94 15.85,14.94 16.46,15.54 16.46,18.25 S2.9
  Bottom 0.406: S2.9 14.25,18.36 13.72,18.9 13.72,22.86 13.41,23.16 S2.5
OSC1
  Top 0.305: IC1.63 62.23,52.38 62.48,52.12 62.79,52.12 63.09,51.82 63.09,48.46 62.18,47.55 58.83,47.55 58.22,46.94 58.22,44.15 Q1.2 58.57,37.87 C36.2 58.5,34.72 57.61,33.83 R6.1
OSC2
  Top 0.305: 68.28,43.59 67.97,43.28 | 67.97,43.28 67.61,43.28 Q1.1 68.28,43.64 68.28,46.94 67.67,47.55 64.31,47.55 63.7,48.16 63.7,52.43 63.4,52.73 63.09,52.73 62.73,53.09 IC1.64 | 67.97,43.28 67.97,38.08 C35.2
PGC2
  Top 0.305: IC1.26 53.16,68.23 52.78,68.61 52.78,69.44 52.12,70.1 42.67,70.1 42.06,69.49 41.45,69.49 41.45,66.67 39.4,64.62 29.26,64.62 26.82,67.06 20.12,67.06 19.05,68.12 J1.5
PGD2
  Top 0.305: IC1.27 54.47,67.74 52.73,67.74 51.99,68.48 51.99,69.04 51.54,69.49 42.98,69.49 42.37,68.89 42.37,66.75 39.62,64.01 14.94,64.01 14.02,64.92 14.02,74.68 14.91,75.56 J1.4
PIO  (via drill 0.6)
  Top 0.305: U$1.8 11.74,43.73 11.89,43.59 27.13,43.59 27.74,44.2 27.74,45.72 29.57,47.55 v38.41,47.55 | v43.28,71.93 56.08,71.93 56.69,71.32 56.69,70.02 IC1.24
  Bottom 0.305: v38.41,47.55 41.15,47.55 42.06,48.46 42.06,70.71 v43.28,71.93
SCK1
  Top 0.305: JP1.3 48.11,48.72 48.46,49.07 48.46,50.7 49.45,51.69 57.35,51.69 58.22,52.55 58.22,54.47 IC1.55
SDI1
  Top 0.305: JP1.4 48.21,51.26 49.2,52.25 57.07,52.25 57.73,52.91 IC1.54
SDO1
  Top 0.305: IC1.53 57.23,53.22 56.84,52.83 49.12,52.83 48.11,53.85 45.77,53.85 JP1.5
VDD  (via drill 0.6)
  Top 0.305: IC1.16 60.73,71.1 59.44,72.39 59.44,74.91 C5.1 | IC1.37 53.2,62.73 51.71,61.24 50.9,61.24 50.55,60.88 C9.1 | J1.2 20.19,78.11 21.03,78.94 21.03,79.86 21.34,80.16 22.58,80.16 C19.1 | IC1.30 53.51,66.23 51.94,67.79 50.55,67.79 | 50.55,67.79 C6.1 | IC1.46 53.25,58.23 52.35,57.33 52.35,56.64 51.89,56.19 50.93,56.19 50.6,55.85 50.6,54.81 | C9.1 50.55,60.91 50.9,61.27 | IC1.2 67.73,72.91 68.89,74.07 70.03,74.07 C27.1 70.18,74.07 v72.85,74.07 | 50.55,67.79 48.28,67.79 v47.55,67.06 | C9.1 47.73,59.87 v47.55,60.05 | 50.6,54.81 48.52,54.81 v47.24,56.08 | IC1.86 71.29,61.23 71.93,61.87 v71.93,63.09 | 50.6,54.81 C13.1 | R6.2 60.31,29.84 v60.66,30.18 | v60.66,52.12 61.11,52.12 61.72,52.73 IC1.62 | C33.1 38.66,74.93 37.8,74.07 37.8,73.15 L2X.2 37.85,69.73 DSR6.2
  Top 0.406: C5.1 57.56,74.93 57,74.37 52.12,74.37 v51.21,75.29 51.73,75.81 R4.2
  Bottom 0.305: v71.93,63.09 48.16,63.09 | v47.24,56.08 47.55,56.39 v47.55,60.05 v47.55,67.06 | v60.66,30.18 61.57,30.18 | C16.1 60.53,52.25 v60.66,52.12
  Bottom 0.406: L2X.2 37.9,73.05 47.75,73.05 49.99,75.29 v51.21,75.29 52.43,74.07 v72.85,74.07
  pour Bottom (isolate 0.254): 1.88,86.61 94.44,87.33 93.52,0.66 1.27,1.27 1.27,25.65
VDDUSB
  Top 0.305: LED1.A LED2.A LED3.A 32.02,2.74 33.83,2.74 34.14,3.05 34.14,10.06 34.44,10.36 C37.2 | JP4.VBUS1 38.02,8.82 37.92,8.91 C37.2 | C37.2 37.8,10.49 37.8,14.94 37.27,15.46 U$2.1 U$2.2